# Altium schematic sheet 元件库.SchDoc
size A4
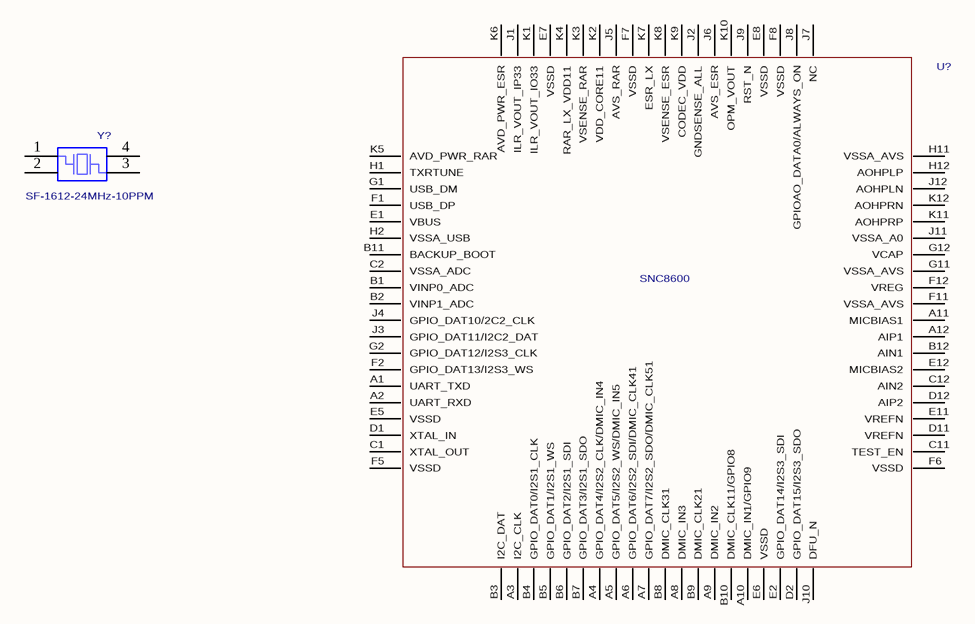
[diagram p0: 元件库.SchDoc]

## Parts
U?  SNC8600  [BGA0405-2]
Y?  value SF-1612-24MHz-10PPM  [SF1612]  (hidden comment: SF1612)

## Nets

Not connected (* = marked no-connect by the designer): U? A1(UART_TXD) A2(UART_RXD) A3(I2C_CLK) A4(GPIO_DAT4/I2S2_CLK/DMIC_IN4) A5(GPIO_DAT5/I2S2_WS/DMIC_IN5) A6(GPIO_DAT6/I2S2_SDI/DMIC_CLK41) A7(GPIO_DAT7/I2S2_SDO/DMIC_CLK51) A8(DMIC_IN3) A9(DMIC_IN2) A10(DMIC_IN1/GPIO9) A11(MICBIAS1) A12(AIP1) B1(VINP0_ADC) B2(VINP1_ADC) B3(I2C_DAT) B4(GPIO_DAT0/I2S1_CLK) B5(GPIO_DAT1/I2S1_WS) B6(GPIO_DAT2/I2S1_SDI) B7(GPIO_DAT3/I2S1_SDO) B8(DMIC_CLK31) B9(DMIC_CLK21) B10(DMIC_CLK11/GPIO8) B11(BACKUP_BOOT) B12(AIN1) C1(XTAL_OUT) C2(VSSA_ADC) C11(TEST_EN) C12(AIN2) D1(XTAL_IN) D2(GPIO_DAT15/I2S3_SDO) D11(VREFN) D12(AIP2) E1(VBUS) E2(GPIO_DAT14/I2S3_SDI) E5(VSSD) E6(VSSD) E7(VSSD) E8(VSSD) E11(VREFN) E12(MICBIAS2) F1(USB_DP) F2(GPIO_DAT13/I2S3_WS) F5(VSSD) F6(VSSD) F7(VSSD) F8(VSSD) F11(VSSA_AVS) F12(VREG) G1(USB_DM) G2(GPIO_DAT12/I2S3_CLK) G11(VSSA_AVS) G12(VCAP) H1(TXRTUNE) H2(VSSA_USB) H11(VSSA_AVS) H12(AOHPLP) J1(ILR_VOUT_IP33) J2(GNDSENSE_ALL) J3(GPIO_DAT11/I2C2_DAT) J4(GPIO_DAT10/2C2_CLK) J5(AVS_RAR) J6(AVS_ESR) J7(NC) J8(GPIOAO_DATA0/ALWAYS_ON) J9(RST_N) J10(DFU_N) J11(VSSA_A0) J12(AOHPLN) K1(ILR_VOUT_IO33) K2(VDD_CORE11) K3(VSENSE_RAR) K4(RAR_LX_VDD11) K5(AVD_PWR_RAR) K6(AVD_PWR_ESR) K7(ESR_LX) K8(VSENSE_ESR) K9(CODEC_VDD) K10(OPM_VOUT) K11(AOHPRP) K12(AOHPRN); Y? 1 2 3 4

## Library data of the parts
U? = BGA_BCHIP-ES2: Value: BCHIP; PCB DECAL: SNC8600
Y? = SF1612: PCB DECAL: SF1612